# Altium schematic sheet FPGA.SchDoc
size B
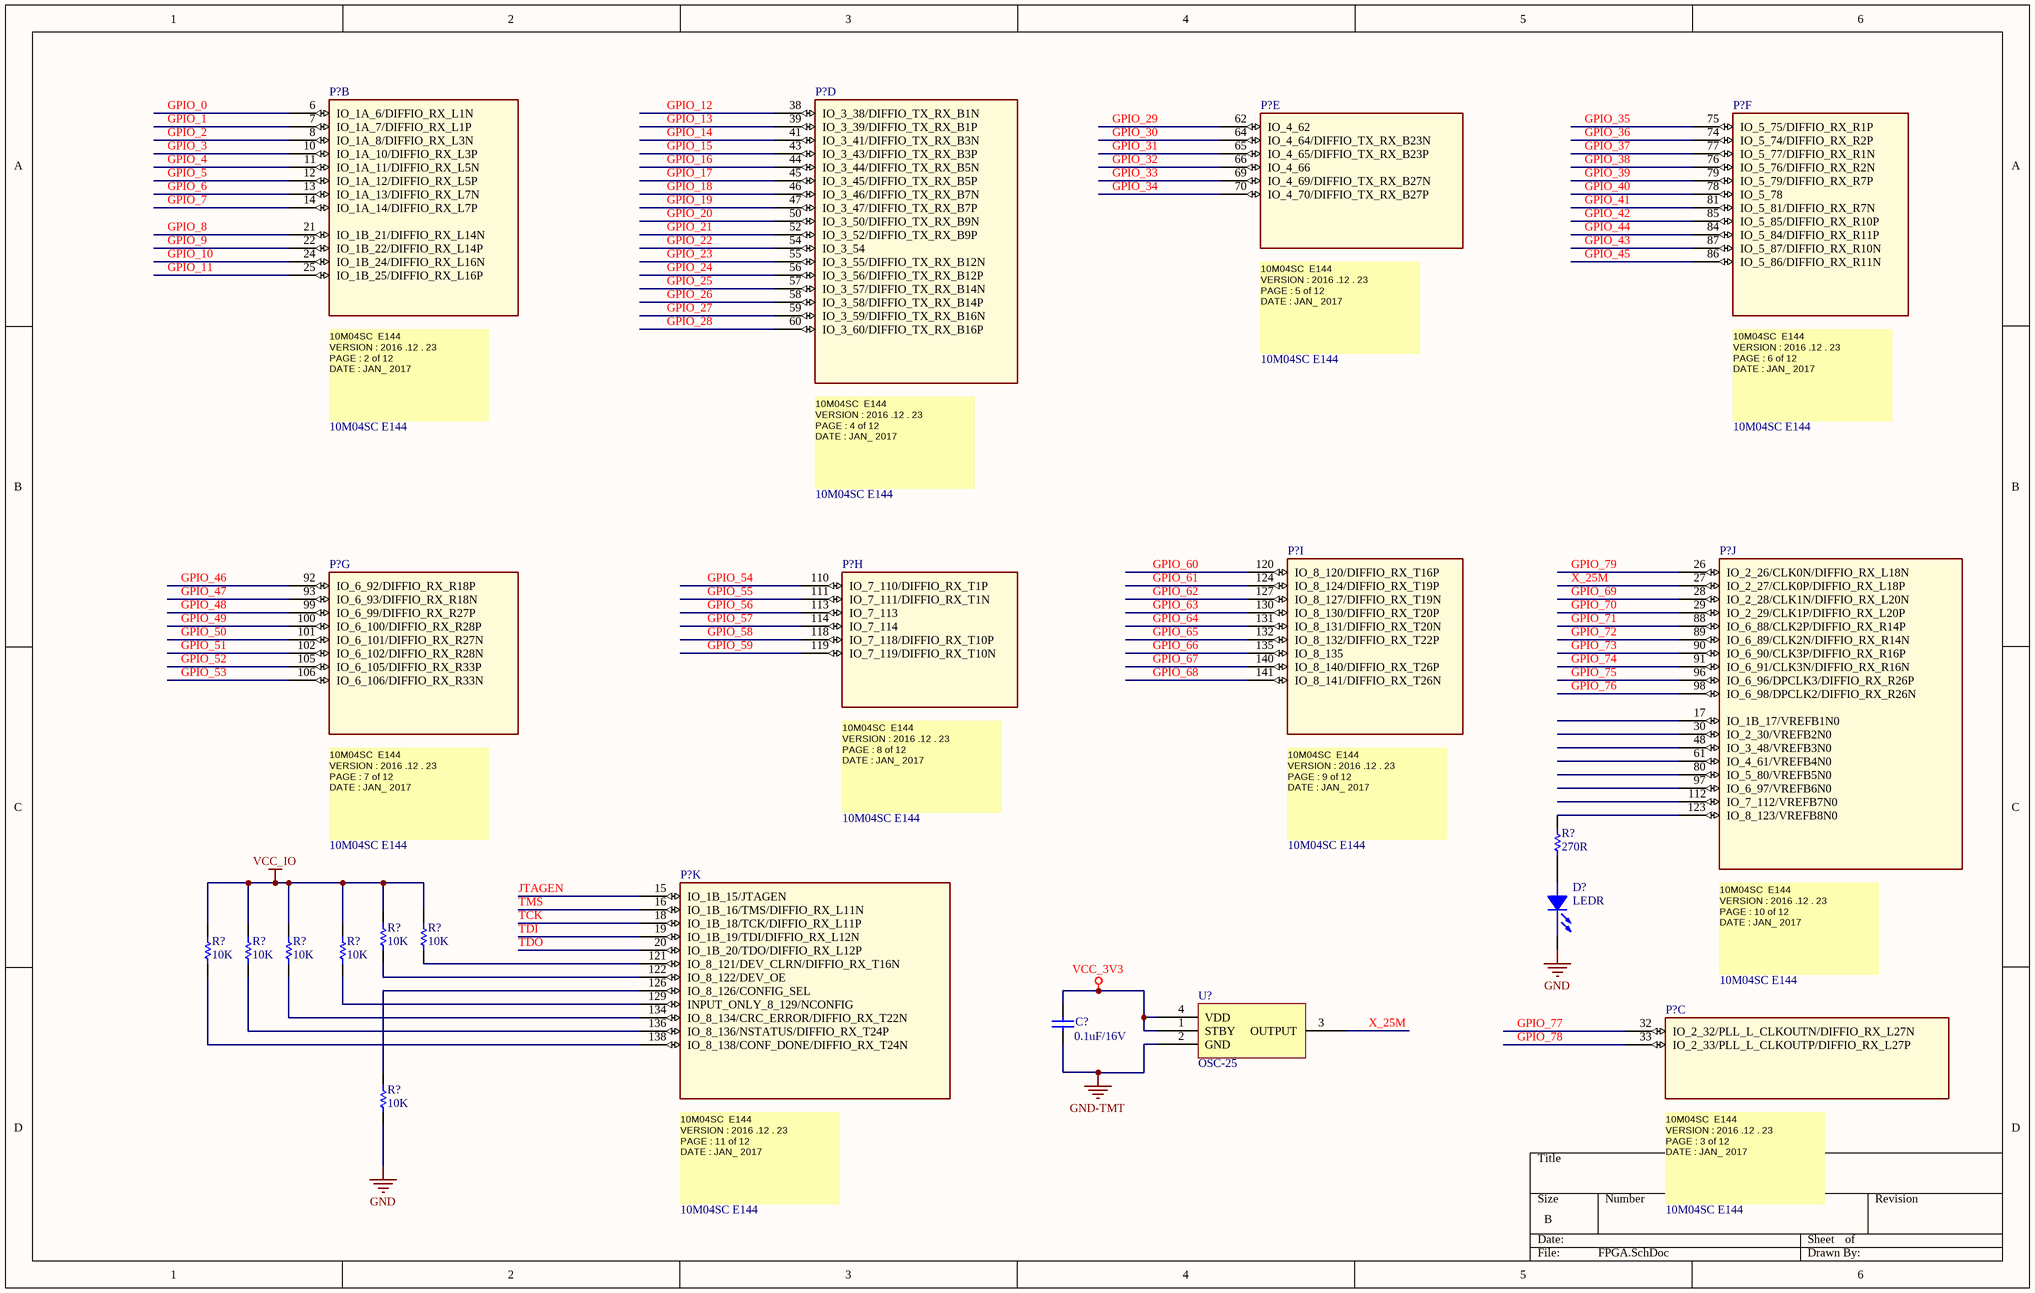
[diagram p0: FPGA.SchDoc]

## Parts
(Parts that share a designator on the sheet are numbered #1, #2 ... from top to bottom, then left to right.)
C?  0.1uF/16V  [0402_CAP]
D?  LEDR  [LED0603]
P?#1  10M04SC E144  (part B of 12)
P?#2  10M04SC E144  (part D of 12)
P?#3  10M04SC E144  (part E of 12)
P?#4  10M04SC E144  (part F of 12)
P?#5  10M04SC E144  (part I of 12)
P?#6  10M04SC E144  (part J of 12)
P?#7  10M04SC E144  (part G of 12)
P?#8  10M04SC E144  (part H of 12)
P?#9  10M04SC E144  (part K of 12)
P?#10  10M04SC E144  (part C of 12)
R?#1  270R  [AXIAL-0.3]
R?#2  10K  [AXIAL-0.3]
R?#3  10K  [AXIAL-0.3]
R?#4  10K  [AXIAL-0.3]
R?#5  10K  [AXIAL-0.3]
R?#6  10K  [AXIAL-0.3]
R?#7  10K  [AXIAL-0.3]
R?#8  10K  [AXIAL-0.3]
U?  OSC-25  [ASE-25.000MHZ-LC-T]

## Nets
GND: D?.2(CATHODE) R?#8.1
GND-TMT: C?.1 U?.2(GND)
VCC_3V3: C?.2 U?.1(STBY) U?.4(VDD)
VCC_IO: R?#2.2 R?#3.2 R?#4.2 R?#5.2 R?#6.2 R?#7.2
GPIO_0: P?#1.6(IO_1A_6/DIFFIO_RX_L1N)
GPIO_1: P?#1.7(IO_1A_7/DIFFIO_RX_L1P)
GPIO_2: P?#1.8(IO_1A_8/DIFFIO_RX_L3N)
GPIO_3: P?#1.10(IO_1A_10/DIFFIO_RX_L3P)
GPIO_4: P?#1.11(IO_1A_11/DIFFIO_RX_L5N)
GPIO_5: P?#1.12(IO_1A_12/DIFFIO_RX_L5P)
GPIO_6: P?#1.13(IO_1A_13/DIFFIO_RX_L7N)
GPIO_7: P?#1.14(IO_1A_14/DIFFIO_RX_L7P)
GPIO_8: P?#1.21(IO_1B_21/DIFFIO_RX_L14N)
GPIO_9: P?#1.22(IO_1B_22/DIFFIO_RX_L14P)
GPIO_10: P?#1.24(IO_1B_24/DIFFIO_RX_L16N)
GPIO_11: P?#1.25(IO_1B_25/DIFFIO_RX_L16P)
GPIO_12: P?#2.38(IO_3_38/DIFFIO_TX_RX_B1N)
GPIO_13: P?#2.39(IO_3_39/DIFFIO_TX_RX_B1P)
GPIO_14: P?#2.41(IO_3_41/DIFFIO_TX_RX_B3N)
GPIO_15: P?#2.43(IO_3_43/DIFFIO_TX_RX_B3P)
GPIO_16: P?#2.44(IO_3_44/DIFFIO_TX_RX_B5N)
GPIO_17: P?#2.45(IO_3_45/DIFFIO_TX_RX_B5P)
GPIO_18: P?#2.46(IO_3_46/DIFFIO_TX_RX_B7N)
GPIO_19: P?#2.47(IO_3_47/DIFFIO_TX_RX_B7P)
GPIO_20: P?#2.50(IO_3_50/DIFFIO_TX_RX_B9N)
GPIO_21: P?#2.52(IO_3_52/DIFFIO_TX_RX_B9P)
GPIO_22: P?#2.54(IO_3_54)
GPIO_23: P?#2.55(IO_3_55/DIFFIO_TX_RX_B12N)
GPIO_24: P?#2.56(IO_3_56/DIFFIO_TX_RX_B12P)
GPIO_25: P?#2.57(IO_3_57/DIFFIO_TX_RX_B14N)
GPIO_26: P?#2.58(IO_3_58/DIFFIO_TX_RX_B14P)
GPIO_27: P?#2.59(IO_3_59/DIFFIO_TX_RX_B16N)
GPIO_28: P?#2.60(IO_3_60/DIFFIO_TX_RX_B16P)
GPIO_29: P?#3.62(IO_4_62)
GPIO_30: P?#3.64(IO_4_64/DIFFIO_TX_RX_B23N)
GPIO_31: P?#3.65(IO_4_65/DIFFIO_TX_RX_B23P)
GPIO_32: P?#3.66(IO_4_66)
GPIO_33: P?#3.69(IO_4_69/DIFFIO_TX_RX_B27N)
GPIO_34: P?#3.70(IO_4_70/DIFFIO_TX_RX_B27P)
GPIO_35: P?#4.75(IO_5_75/DIFFIO_RX_R1P)
GPIO_36: P?#4.74(IO_5_74/DIFFIO_RX_R2P)
GPIO_37: P?#4.77(IO_5_77/DIFFIO_RX_R1N)
GPIO_38: P?#4.76(IO_5_76/DIFFIO_RX_R2N)
GPIO_39: P?#4.79(IO_5_79/DIFFIO_RX_R7P)
GPIO_40: P?#4.78(IO_5_78)
GPIO_41: P?#4.81(IO_5_81/DIFFIO_RX_R7N)
GPIO_42: P?#4.85(IO_5_85/DIFFIO_RX_R10P)
GPIO_43: P?#4.87(IO_5_87/DIFFIO_RX_R10N)
GPIO_44: P?#4.84(IO_5_84/DIFFIO_RX_R11P)
GPIO_45: P?#4.86(IO_5_86/DIFFIO_RX_R11N)
GPIO_46: P?#7.92(IO_6_92/DIFFIO_RX_R18P)
GPIO_47: P?#7.93(IO_6_93/DIFFIO_RX_R18N)
GPIO_48: P?#7.99(IO_6_99/DIFFIO_RX_R27P)
GPIO_49: P?#7.100(IO_6_100/DIFFIO_RX_R28P)
GPIO_50: P?#7.101(IO_6_101/DIFFIO_RX_R27N)
GPIO_51: P?#7.102(IO_6_102/DIFFIO_RX_R28N)
GPIO_52: P?#7.105(IO_6_105/DIFFIO_RX_R33P)
GPIO_53: P?#7.106(IO_6_106/DIFFIO_RX_R33N)
GPIO_54: P?#8.110(IO_7_110/DIFFIO_RX_T1P)
GPIO_55: P?#8.111(IO_7_111/DIFFIO_RX_T1N)
GPIO_56: P?#8.113(IO_7_113)
GPIO_57: P?#8.114(IO_7_114)
GPIO_58: P?#8.118(IO_7_118/DIFFIO_RX_T10P)
GPIO_59: P?#8.119(IO_7_119/DIFFIO_RX_T10N)
GPIO_60: P?#5.120(IO_8_120/DIFFIO_RX_T16P)
GPIO_61: P?#5.124(IO_8_124/DIFFIO_RX_T19P)
GPIO_62: P?#5.127(IO_8_127/DIFFIO_RX_T19N)
GPIO_63: P?#5.130(IO_8_130/DIFFIO_RX_T20P)
GPIO_64: P?#5.131(IO_8_131/DIFFIO_RX_T20N)
GPIO_65: P?#5.132(IO_8_132/DIFFIO_RX_T22P)
GPIO_66: P?#5.135(IO_8_135)
GPIO_67: P?#5.140(IO_8_140/DIFFIO_RX_T26P)
GPIO_68: P?#5.141(IO_8_141/DIFFIO_RX_T26N)
GPIO_69: P?#6.28(IO_2_28/CLK1N/DIFFIO_RX_L20N)
GPIO_70: P?#6.29(IO_2_29/CLK1P/DIFFIO_RX_L20P)
GPIO_71: P?#6.88(IO_6_88/CLK2P/DIFFIO_RX_R14P)
GPIO_72: P?#6.89(IO_6_89/CLK2N/DIFFIO_RX_R14N)
GPIO_73: P?#6.90(IO_6_90/CLK3P/DIFFIO_RX_R16P)
GPIO_74: P?#6.91(IO_6_91/CLK3N/DIFFIO_RX_R16N)
GPIO_75: P?#6.96(IO_6_96/DPCLK3/DIFFIO_RX_R26P)
GPIO_76: P?#6.98(IO_6_98/DPCLK2/DIFFIO_RX_R26N)
GPIO_77: P?#10.32(IO_2_32/PLL_L_CLKOUTN/DIFFIO_RX_L27N)
GPIO_78: P?#10.33(IO_2_33/PLL_L_CLKOUTP/DIFFIO_RX_L27P)
GPIO_79: P?#6.26(IO_2_26/CLK0N/DIFFIO_RX_L18N)
JTAGEN: P?#9.15(IO_1B_15/JTAGEN)
TCK: P?#9.18(IO_1B_18/TCK/DIFFIO_RX_L11P)
TDI: P?#9.19(IO_1B_19/TDI/DIFFIO_RX_L12N)
TDO: P?#9.20(IO_1B_20/TDO/DIFFIO_RX_L12P)
TMS: P?#9.16(IO_1B_16/TMS/DIFFIO_RX_L11N)
X_25M: P?#6.27(IO_2_27/CLK0P/DIFFIO_RX_L18P) U?.3(OUTPUT)
NetD?_1: D?.1(ANODE) R?#1.1
NetP?#6_123: P?#6.123(IO_8_123/VREFB8N0) R?#1.2
NetP?#9_121: P?#9.121(IO_8_121/DEV_CLRN/DIFFIO_RX_T16N) R?#3.1
NetP?#9_122: P?#9.122(IO_8_122/DEV_OE) R?#2.1
NetP?#9_126: P?#9.126(IO_8_126/CONFIG_SEL) R?#8.2
NetP?#9_129: P?#9.129(INPUT_ONLY_8_129/NCONFIG) R?#7.1
NetP?#9_134: P?#9.134(IO_8_134/CRC_ERROR/DIFFIO_RX_T22N) R?#6.1
NetP?#9_136: P?#9.136(IO_8_136/NSTATUS/DIFFIO_RX_T24P) R?#5.1
NetP?#9_138: P?#9.138(IO_8_138/CONF_DONE/DIFFIO_RX_T24N) R?#4.1

Not connected (* = marked no-connect by the designer): P?#6 17(IO_1B_17/VREFB1N0) 30(IO_2_30/VREFB2N0) 48(IO_3_48/VREFB3N0) 61(IO_4_61/VREFB4N0) 80(IO_5_80/VREFB5N0) 97(IO_6_97/VREFB6N0) 112(IO_7_112/VREFB7N0)

## Notes on the sheet
- (in symbol 10M04SC E144, part B) 10M04SC  E144 / VERSION : 2016 .12 . 23 / PAGE : 2 of 12 / DATE : JAN_ 2017 /
- (in symbol 10M04SC E144, part C) 10M04SC  E144 / VERSION : 2016 .12 . 23 / PAGE : 3 of 12 / DATE : JAN_ 2017 /
- (in symbol 10M04SC E144, part D) 10M04SC  E144 / VERSION : 2016 .12 . 23 / PAGE : 4 of 12 / DATE : JAN_ 2017 /
- (in symbol 10M04SC E144, part E) 10M04SC  E144 / VERSION : 2016 .12 . 23 / PAGE : 5 of 12 / DATE : JAN_ 2017 /
- (in symbol 10M04SC E144, part F) 10M04SC  E144 / VERSION : 2016 .12 . 23 / PAGE : 6 of 12 / DATE : JAN_ 2017 /
- (in symbol 10M04SC E144, part G) 10M04SC  E144 / VERSION : 2016 .12 . 23 / PAGE : 7 of 12 / DATE : JAN_ 2017 /
- (in symbol 10M04SC E144, part H) 10M04SC  E144 / VERSION : 2016 .12 . 23 / PAGE : 8 of 12 / DATE : JAN_ 2017 /
- (in symbol 10M04SC E144, part I) 10M04SC  E144 / VERSION : 2016 .12 . 23 / PAGE : 9 of 12 / DATE : JAN_ 2017 /
- (in symbol 10M04SC E144, part J) 10M04SC  E144 / VERSION : 2016 .12 . 23 / PAGE : 10 of 12 / DATE : JAN_ 2017 /
- (in symbol 10M04SC E144, part K) 10M04SC  E144 / VERSION : 2016 .12 . 23 / PAGE : 11 of 12 / DATE : JAN_ 2017 /

## Library data of the parts
C? = Cap: Multilayer Ceramic Capacitors MLCC - SMD/SMT 10% AEC-Q200 16V 0.1uF X7R 0402; Mfr Part No: C0402T104K4RACTU; Manufacturer: KEMET; Value: 0.1uF/16V; Stockiest: MOUSER; Stockiest Part No: 80-C0402T104K4RACTU; Package: 0402; Price: 0.1
D? = LED: Standard LEDs - SMD Red 631nm 14mcd 5mA; Manufacturer: Lite-On; Mfr Part No: LTST-C193KRKT-5A; Package: 0603; Price: 0.28; Stockiest Part No: 859-LTSTC193KRKT5A; Value: RED; Stockiest: MOUSER
P?#1-P?#10 = 10M04SC E144: SPLIT_INST: TRUE; SWAP_INFO: (S1+S2+S3+S4+S5+S6+S7+S8+S9+S10+S11+S12)
R?#1-R?#8 = Res1: Resistor; Published: 8-Jun-2000; LatestRevisionDate: 17-Jul-2002; LatestRevisionNote: Re-released for DXP Platform.; PackageReference: AXIAL-0.3; Publisher: Altium Limited; PackageDescription: Axial Device, Thru-Hole; 2 Leads; 0.3 in Pin Spacing
  R?#1: Value: 270R
  R?#2-R?#8: Value: 10K
U? = CRYSTAL: Standard Clock Oscillators 25.0 MHZ 3.3V 50PPM SMD 32; Manufacturer: Abracon; Value: 25MHZ; Stockiest: MOUSER; Stockiest Part No: 815-ASE25.000MHZLCT; Mfr Part No: ASE-25.000MHZ-LC-T; Package: SMD; Price: 1.5